# EAGLE design DMXW_Driver_Board (EAGLE 6.5.0)
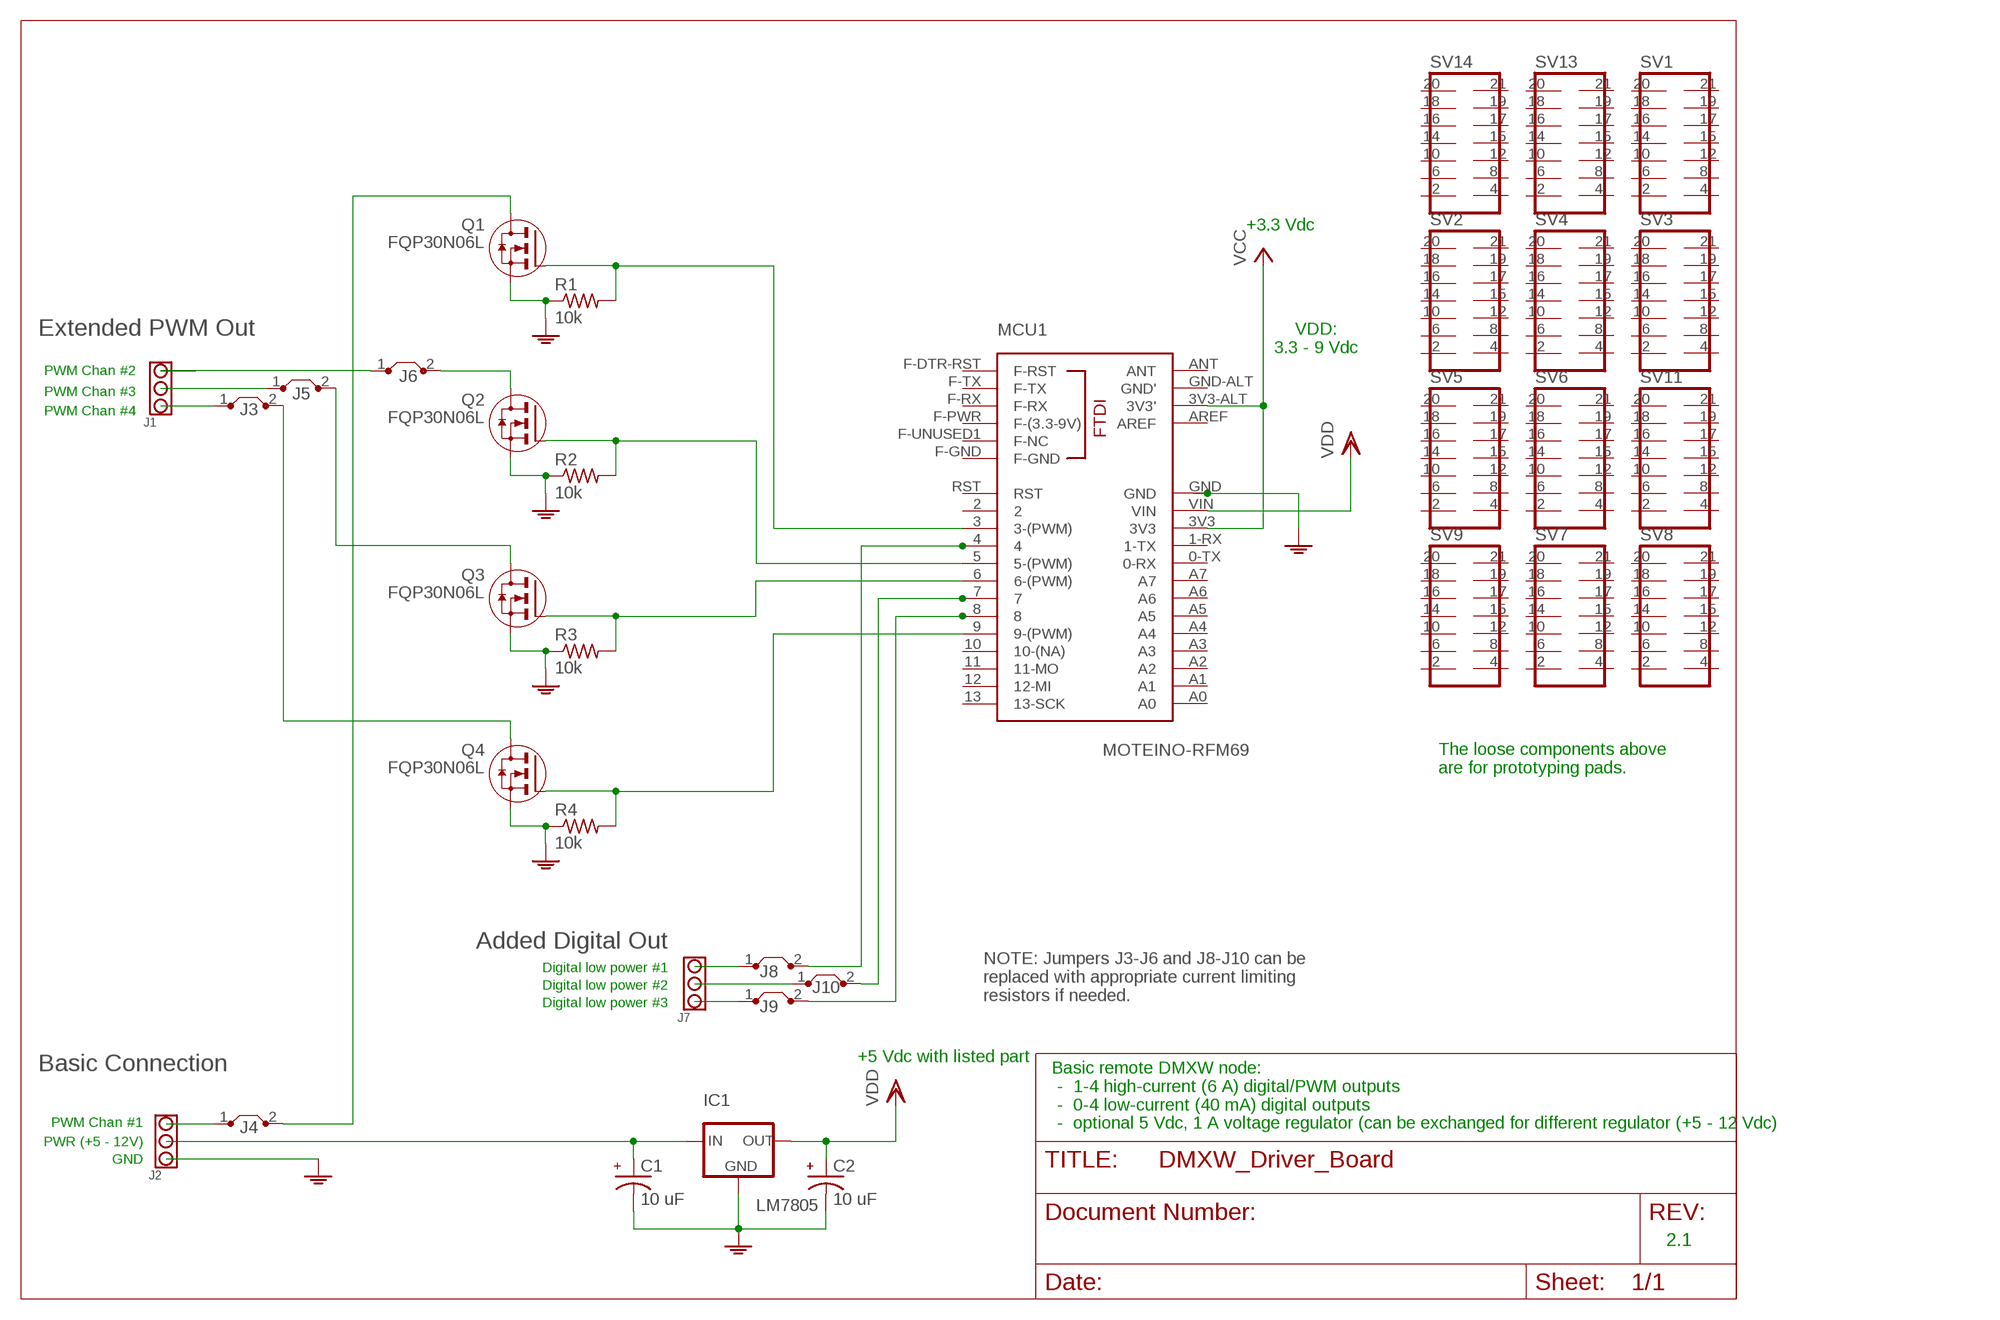
[diagram p0: schematic, sheet 1]

## Parts
C1  10 uF  CAPACITOR-ELECTROLYTICCANISTERRADIAL  [RADIAL-CANISTER]
C2  10 uF  CAPACITOR-ELECTROLYTICCANISTERRADIAL  [RADIAL-CANISTER]
IC1  LM7805  78XX-VOLTAGEREGULATORSHOZ  [TO-220-HORIZONTAL]
J1  TERMINAL-BLOCK-3  [W237-103]
J2  TERMINAL-BLOCK-3  [W237-103]
J3  J5MM  [05]
J4  J5MM  [05]
J5  J5MM  [05]
J6  J5MM  [05]
J7  TERMINAL-BLOCK-3  [W237-103]
J8  J5MM  [05]
J9  J5MM  [05]
J10  J5MM  [05]
MCU1  MOTEINO-RFM69  [MOTEINO]
Q1  FQP30N06L  MOSFET-N-FQP30N06LHORIZ  [TO-220-HORIZONTAL]
Q2  FQP30N06L  MOSFET-N-FQP30N06LHORIZ  [TO-220-HORIZONTAL]
Q3  FQP30N06L  MOSFET-N-FQP30N06LHORIZ  [TO-220-HORIZONTAL]
Q4  FQP30N06L  MOSFET-N-FQP30N06LHORIZ  [TO-220-HORIZONTAL]
R1  10k  R-US_0207/10  [0207/10]
R2  10k  R-US_0207/10  [0207/10]
R3  10k  R-US_0207/10  [0207/10]
R4  10k  R-US_0207/10  [0207/10]
SV1  14P  [14P]
SV2  14P  [14P]
SV3  14P  [14P]
SV4  14P  [14P]
SV5  14P  [14P]
SV6  14P  [14P]
SV7  14P  [14P]
SV8  14P  [14P]
SV9  14P  [14P]
SV11  14P  [14P]
SV13  14P  [14P]
SV14  14P  [14P]

## Nets
GND: C1.- C2.- IC1.PIN2(GND) J2.3 MCU1.GND Q1.PIN3(S) Q2.PIN3(S) Q3.PIN3(S) Q4.PIN3(S) R1.1 R2.1 R3.1 R4.1
N$1: MCU1.5(5-(PWM)) Q2.PIN1(G) R2.2
N$2: J1.1 J6.1
N$3: J1.2 J5.1
N$4: J6.2 Q2.PIN2(D)
N$5: C1.+ IC1.PIN1(IN) J2.2
N$6: MCU1.6(6-(PWM)) Q3.PIN1(G) R3.2
N$7: J5.2 Q3.PIN2(D)
N$8: MCU1.9(9-(PWM)) Q4.PIN1(G) R4.2
N$9: J3.2 Q4.PIN2(D)
N$10: J8.2 MCU1.4
N$11: J10.2 MCU1.7
N$12: MCU1.3(3-(PWM)) Q1.PIN1(G) R1.2
N$13: J4.2 Q1.PIN2(D)
N$14: J9.2 MCU1.8
N$16: J7.2 J10.1
N$17: J2.1 J4.1
N$18: J1.3 J3.1
N$20: J7.1 J8.1
N$21: J7.3 J9.1
VCC: MCU1.3V3 MCU1.3V3-ALT(3V3')
VDD: C2.+ IC1.PIN3(OUT) MCU1.VIN
Unconnected: MCU1.0-TX(0-RX) MCU1.1-RX(1-TX) MCU1.2 MCU1.10(10-(NA)) MCU1.11(11-MO) MCU1.12(12-MI) MCU1.13(13-SCK) MCU1.A0 MCU1.A1 MCU1.A2 MCU1.A3 MCU1.A4 MCU1.A5 MCU1.A6 MCU1.A7 MCU1.ANT MCU1.AREF MCU1.F-DTR-RST(F-RST) MCU1.F-GND MCU1.F-PWR(F-(3.3-9V)) MCU1.F-RX MCU1.F-TX MCU1.F-UNUSED1(F-NC) MCU1.GND-ALT(GND') MCU1.RST SV1.2 SV1.4 SV1.6 SV1.8 SV1.10 SV1.12 SV1.14 SV1.15 SV1.16 SV1.17 SV1.18 SV1.19 SV1.20 SV1.21 SV2.2 SV2.4 SV2.6 SV2.8 SV2.10 SV2.12 SV2.14 SV2.15 SV2.16 SV2.17 SV2.18 SV2.19 SV2.20 SV2.21 SV3.2 SV3.4 SV3.6 SV3.8 SV3.10 SV3.12 SV3.14 SV3.15 SV3.16 SV3.17 SV3.18 SV3.19 SV3.20 SV3.21 SV4.2 SV4.4 SV4.6 SV4.8 SV4.10 SV4.12 SV4.14 SV4.15 SV4.16 SV4.17 SV4.18 SV4.19 SV4.20 SV4.21 SV5.2 SV5.4 SV5.6 SV5.8 SV5.10 SV5.12 SV5.14 SV5.15 SV5.16 SV5.17 SV5.18 SV5.19 SV5.20 SV5.21 SV6.2 SV6.4 SV6.6 SV6.8 SV6.10 SV6.12 SV6.14 SV6.15 SV6.16 SV6.17 SV6.18 SV6.19 SV6.20 SV6.21 SV7.2 SV7.4 SV7.6 SV7.8 SV7.10 SV7.12 SV7.14 SV7.15 SV7.16 SV7.17 SV7.18 SV7.19 SV7.20 SV7.21 SV8.2 SV8.4 SV8.6 SV8.8 SV8.10 SV8.12 SV8.14 SV8.15 SV8.16 SV8.17 SV8.18 SV8.19 SV8.20 SV8.21 SV9.2 SV9.4 SV9.6 SV9.8 SV9.10 SV9.12 SV9.14 SV9.15 SV9.16 SV9.17 SV9.18 SV9.19 SV9.20 SV9.21 SV11.2 SV11.4 SV11.6 SV11.8 SV11.10 SV11.12 SV11.14 SV11.15 SV11.16 SV11.17 SV11.18 SV11.19 SV11.20 SV11.21 SV13.2 SV13.4 SV13.6 SV13.8 SV13.10 SV13.12 SV13.14 SV13.15 SV13.16 SV13.17 SV13.18 SV13.19 SV13.20 SV13.21 SV14.2 SV14.4 SV14.6 SV14.8 SV14.10 SV14.12 SV14.14 SV14.15 SV14.16 SV14.17 SV14.18 SV14.19 SV14.20 SV14.21

## Notes on the sheet
- +3.3 Vdc
- Extended PWM Out
- VDD:
  3.3 - 9 Vdc
- PWM Chan #2
- PWM Chan #3
- PWM Chan #4
- The loose components above
  are for prototyping pads.
- Added Digital Out
- Digital low power #1
- Digital low power #2
- Digital low power #3
- NOTE: Jumpers J3-J6 and J8-J10 can be
  replaced with appropriate current limiting
  resistors if needed.
- +5 Vdc with listed part
- Basic Connection
- PWM Chan #1
- Basic remote DMXW node:
   -  1-4 high-current (6 A) digital/PWM outputs
   -  0-4 low-current (40 mA) digital outputs
   -  optional 5 Vdc, 1 A voltage regulator (can be exchanged for different regulator (+5 - 12 Vdc)
- PWR (+5 - 12V)
- GND
- 2.1

## Library data of the parts
C1 C2 = JvS:CAPACITOR-ELECTROLYTIC: Electrolytic capacitor, American symbol
IC1 = JvS:78XX-VOLTAGEREGULATORS: 78XX series voltage regulators
J1 J2 J7 = JvS:TERMINAL-BLOCK-3: WAGO SCREW CLAMP
J3-J6 J8-J10 = jumper:J: Bridge
MCU1 = JvS:MOTEINO: Arduino compatible 3.3Vdc microcontroller with RFM69 radio
Q1-Q4 = JvS:MOSFET-N-FQP30N06L: 32A, 60V, 0.032 Ohm, N-Channel Logic Level MOSFET Source: Fairchild Semiconductor Corporation
R1-R4 = rcl:R-US_: RESISTOR, American symbol
SV1-SV9 SV11 SV13 SV14 = JvS:14P: DIL CABLE CONNECTOR

## Board
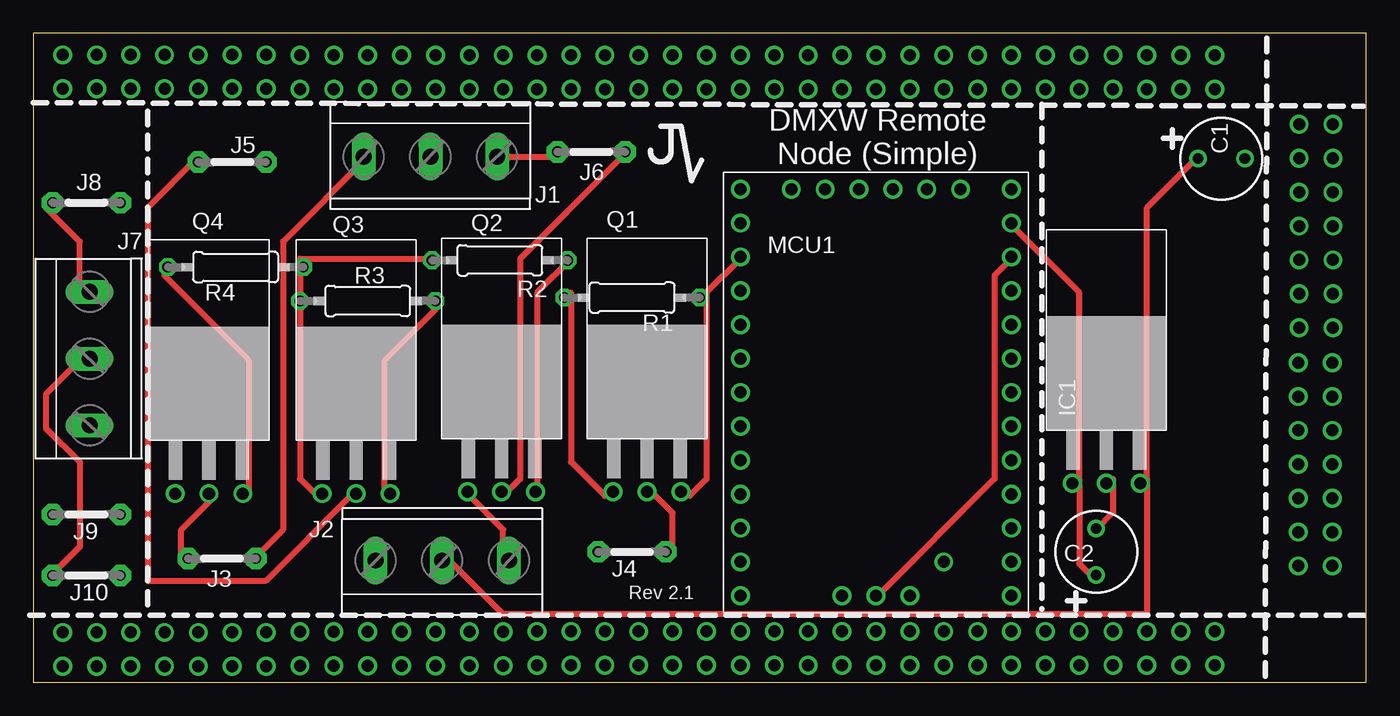
[diagram p1: board, top side]
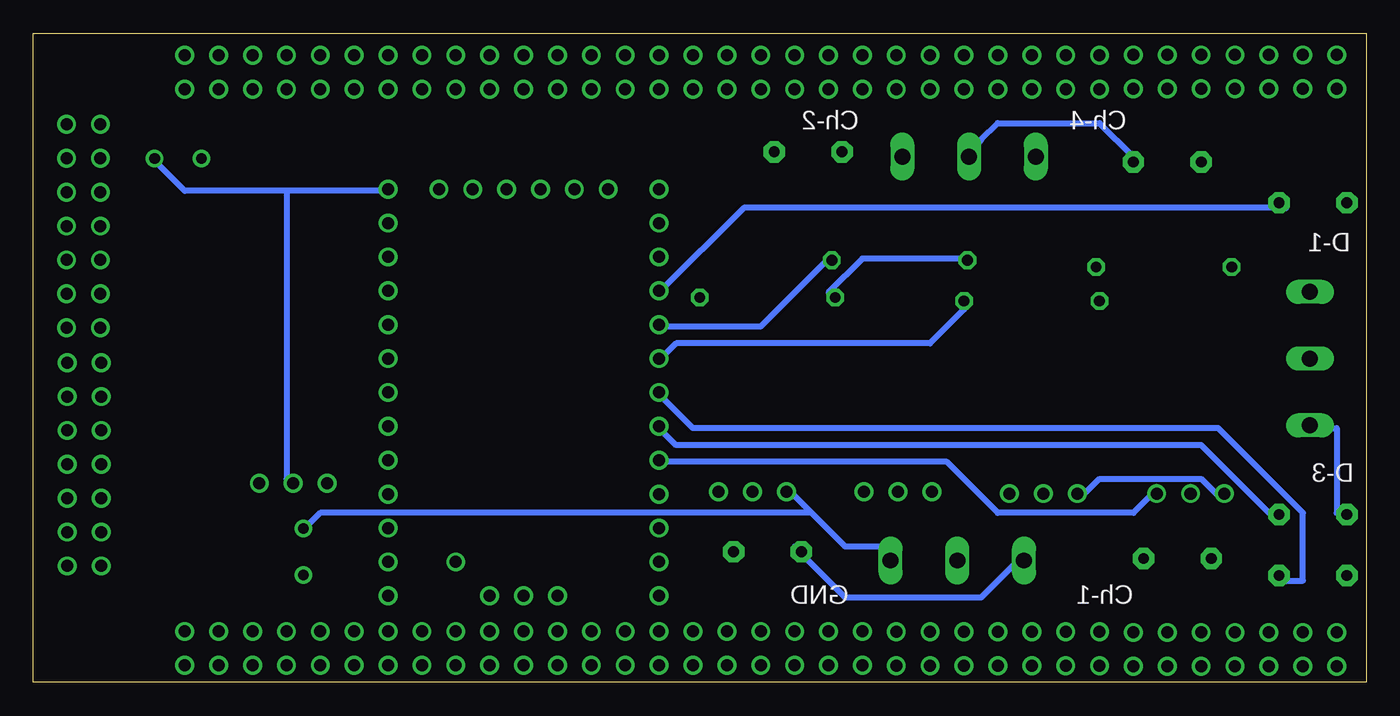
[diagram p2: board, bottom side, seen from below]

Size 99.92 x 48.63 mm. Coordinates in mm from the lower left corner, seen from the top.
Outline: 0,0 99.92,0 99.92,48.63 0,48.63 0,0
Copper layers (1*16): Top 0.035mm / dielectric 1.5mm / Bottom 0.035mm
Design rules "SeeedStudio_2layer_DRU_no_angle_20140221_JVS-extra_wide_traces": minimum track width 18mil, minimum drill 12mil, track to track 6mil, track to pad 6mil, pad to pad 6mil, via to via 6mil, smd to smd 0mil, copper to edge 10mil, drill to drill 10mil, minimum pad ring 10mil, minimum via ring 6mil, stop-mask expansion 2mil, vias tented up to drill 100mil, thermal gap 10mil

### Footprints (pad centres in the part's own frame; a part is rotated, then mirrored left to right if it is on the bottom)
RADIAL-CANISTER = drill 0.8 pad 1.27: + 1.75,0; - -1.75,0
TO-220-HORIZONTAL = drill 0.9: PIN1 2.54,-4.02; PIN2 0,-4.02; PIN3 -2.54,-4.02
W237-103 = drill 1.194 long: 1 -5,-1.29; 2 0,-1.29; 3 5,-1.29
05 = drill 0.813 pad 1.6 octagon: 1 -2.54,0; 2 2.54,0
MOTEINO = drill 0.9: 0-TX 10.16,5.08; 1-RX 10.16,7.62; 2 -10.16,12.7; 3 -10.16,10.16; 3V3 10.16,10.16; 3V3-ALT 0,-15.24; 4 -10.16,7.62; 5 -10.16,5.08; 6 -10.16,2.54; 7 -10.16,0; 8 -10.16,-2.54; 9 -10.16,-5.08; 10 -10.16,-7.62; 11 -10.16,-10.16; 12 -10.16,-12.7; 13 -10.16,-15.24; A0 10.16,-15.24; A1 10.16,-12.7; A2 10.16,-10.16; A3 10.16,-7.62; A4 10.16,-5.08; A5 10.16,-2.54; A6 10.16,0; A7 10.16,2.54; ANT 5.08,-12.7; AREF -2.54,-15.24; F-DTR-RST 6.35,15.24; F-GND -6.35,15.24; F-PWR -1.27,15.24; F-RX 1.27,15.24; F-TX 3.81,15.24; F-UNUSED1 -3.81,15.24; GND 10.16,15.24; GND-ALT 2.54,-15.24; RST -10.16,15.24; VIN 10.16,12.7
0207/10 = drill 0.813 octagon: 1 -5.08,0; 2 5.08,0
14P = drill 0.9: 2 -7.62,1.27; 4 -5.08,1.27; 6 -2.54,1.27; 8 0,1.27; 10 2.54,1.27; 12 5.08,1.27; 14 7.62,1.27; 15 -7.62,-1.27; 16 -5.08,-1.27; 17 -2.54,-1.27; 18 0,-1.27; 19 2.54,-1.27; 20 5.08,-1.27; 21 7.62,-1.27

### Placement (x,y rotation side)
C1  89.08,39.24 180 top
C2  79.68,9.78 270 top
IC1  80.44,18.92 0 top
J1  29.77,38.1 180 top
J2  30.66,10.41 0 top
J3  14.15,9.27 180 top
J4  44.88,9.78 0 top
J5  14.91,38.99 180 top
J6  41.83,39.75 0 top
J7  5.51,24.26 270 top
J8  3.99,35.94 0 top
J9  3.99,12.57 0 top
J10  3.99,8 0 top
MCU1  63.17,21.72 0 top
Q1  46.01,18.29 0 top
Q2  35.1,18.29 0 top
Q3  24.2,18.16 0 top
Q4  13.16,18.16 0 top
R1  44.88,28.83 0 top
R2  34.98,31.62 0 top
R3  25.07,28.58 0 top
R4  15.16,31.12 180 top
SV1  96.16,34.19 90 top
SV2  96.11,16.33 90 top
SV3  27.61,2.51 0 top
SV4  27.61,45.72 0 top
SV5  45.39,2.54 0 top
SV6  63.17,2.54 0 top
SV7  45.39,45.72 0 top
SV8  63.17,45.72 0 top
SV9  80.95,45.72 0 top
SV11  80.95,2.54 0 top
SV13  9.83,45.75 0 top
SV14  9.83,2.46 0 top

### Tracks (layer width: path | path; a pad name or v marks a point on that pad's centre or on a via)
GND
  Top 0.457: C2.- 79.68,11.43 80.95,12.7 80.95,15.24 IC1.PIN2 | Q2.PIN3 32.69,13.97 35.23,11.43 35.23,10.16 J2.3 | R2.1 30.15,31.75 19.99,31.75 R4.1 19.99,30.48 R3.1 19.99,15.24 21.26,13.97 Q3.PIN3 | Q1.PIN3 42.85,13.97 40.31,16.51 40.31,29.21 R1.1
  Bottom 0.457: 80.95,36.83 73.33,36.83 MCU1.GND | 80.95,36.83 88.57,36.83 91.11,39.37 C1.- | 80.95,36.83 80.95,15.24 IC1.PIN2 | 41.58,12.7 39.04,10.16 36.5,10.16 J2.3 | 41.58,12.7 42.85,13.97 Q1.PIN3 | Q4.PIN3 11.1,13.97 12.37,15.24 19.99,15.24 21.26,13.97 Q3.PIN3 | R1.1 40.31,29.21 37.77,31.75 30.15,31.75 R2.1 | 41.58,12.7 78.41,12.7 79.68,11.43 C2.-
N$1
  Top 0.457: Q2.PIN1 37.77,13.97 37.77,29.21 40.31,31.75 R2.2
  Bottom 0.457: R2.2 40.31,31.75 45.39,26.67 53.01,26.67 MCU1.5
N$2
  Top 0.457: J6.1 39.04,39.37 35.23,39.37 J1.1
N$3
  Bottom 0.457: J5.1 17.45,39.37 19.99,41.91 27.61,41.91 28.88,40.64 J1.2
N$4
  Top 0.457: Q2.PIN2 35.23,13.97 36.5,15.24 36.5,31.75 44.12,39.37 J6.2
N$5
  Top 0.457: 83.49,15.24 83.49,35.56 87.3,39.37 C1.+ | 83.49,15.24 83.49,5.08 35.23,5.08 31.42,8.89 J2.2 | 83.49,15.24 IC1.PIN1
N$6
  Top 0.457: R3.2 30.15,27.94 26.34,24.13 26.34,13.97 Q3.PIN1
  Bottom 0.457: MCU1.6 53.01,24.13 51.74,25.4 32.69,25.4 30.15,27.94 R3.2
N$7
  Top 0.457: Q3.PIN2 23.8,13.97 17.45,7.62 8.56,7.62 8.56,35.56 12.37,39.37 J5.2
N$8
  Top 0.457: R4.2 9.83,30.48 16.18,24.13 16.18,13.97 Q4.PIN1
  Bottom 0.457: MCU1.9 53.01,16.51 31.42,16.51 27.61,12.7 17.45,12.7 16.18,13.97 Q4.PIN1
N$9
  Top 0.457: Q4.PIN2 13.64,13.97 11.1,11.43 11.1,8.89 J3.2
N$10
  Bottom 0.457: MCU1.4 53.01,29.21 46.66,35.56 6.02,35.56 J8.2
N$11
  Bottom 0.457: MCU1.7 53.01,21.59 50.47,19.05 11.1,19.05 4.75,12.7 4.75,7.62 6.02,7.62 J10.2
N$12
  Top 0.457: 50.47,29.21 53.01,31.75 MCU1.3 | 50.47,29.21 50.47,15.24 49.2,13.97 Q1.PIN1 | 50.47,29.21 R1.2
N$13
  Top 0.457: Q1.PIN2 46.66,13.97 47.93,12.7 47.93,10.16 J4.2
N$14
  Bottom 0.457: MCU1.8 53.01,19.05 51.74,17.78 12.37,17.78 7.29,12.7 J9.2
N$16
  Top 0.457: J10.1 0.94,7.62 3.48,10.16 3.48,16.51 0.94,19.05 0.94,21.59 3.48,24.13 J7.2
N$17
  Bottom 0.457: J4.1 42.85,10.16 39.04,6.35 28.88,6.35 26.34,8.89 J2.1
N$18
  Top 0.457: J3.1 16.18,8.89 18.72,11.43 18.72,33.02 25.07,39.37 J1.3
N$20
  Top 0.457: J8.1 0.94,35.56 3.48,33.02 3.48,29.21 J7.1
N$21
  Bottom 0.457: J9.1 2.21,12.7 2.21,19.05 3.48,19.05 J7.3
VCC
  Top 0.457: MCU1.3V3-ALT 63.17,6.35 72.06,15.24 72.06,30.48 73.33,31.75 MCU1.3V3
VDD
  Top 0.457: 78.41,15.24 78.41,8.89 79.68,7.62 C2.+ | 78.41,15.24 78.41,29.21 73.33,34.29 MCU1.VIN | 78.41,15.24 IC1.PIN3

### Text on the board
tNames: DMXW Remote / Node (Simple) | Rev 2.1
bNames: Ch-4 | Ch-2 | D-1 | D-3 | Ch-1 | GND